# Altium schematic sheet Lilypad_Schematic_1.SchDoc
size A4
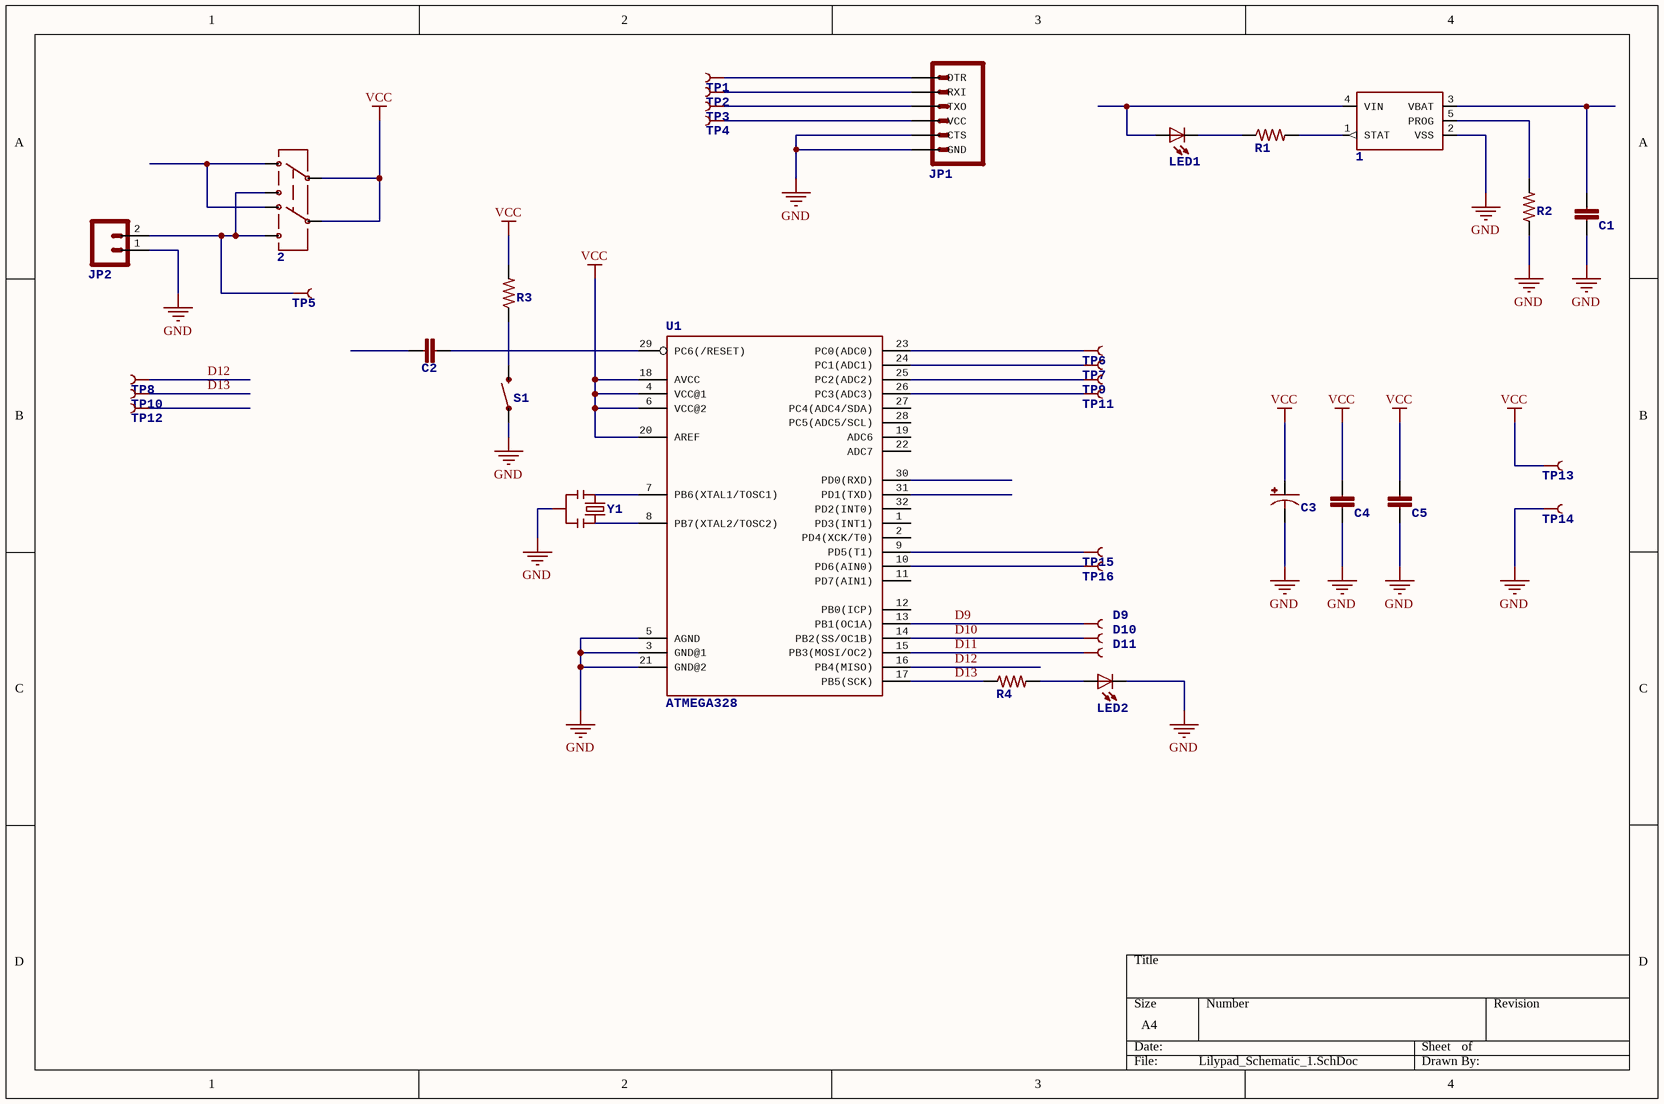
[diagram p0: Lilypad_Schematic_1.SchDoc]

## Parts
1  MCP73831  [SOT23-5]  (value not drawn)
2  AYZ0202  [AYZ0202]  (value not drawn)
C1  CAP0402-CAP  [0402-CAP]  (value not drawn)
C2  CAP0402-CAP  [0402-CAP]  (value not drawn)
C3  CAP_POL3528  [EIA3528]  (value not drawn)
C4  CAP0402-CAP  [0402-CAP]  (value not drawn)
C5  CAP0402-CAP  [0402-CAP]  (value not drawn)
D9  CONN  [PETAL-LONG-2]  (value not drawn)
D10  CONN  [PETAL-LONG-2]  (value not drawn)
D11  CONN  [PETAL-LONG-2]  (value not drawn)
JP1  ARDUINO_SERIAL_PROGRAMSMD  [1X06-SMD]  (value not drawn)
JP2  M02-JST-2MM-SMT  [JST-2-SMD]  (value not drawn)
LED1  LED0603  [LED-0603]  (value not drawn)
LED2  LED0603  [LED-0603]  (value not drawn)
R1  RESISTOR0402-RES  [0402-RES]  (value not drawn)
R2  RESISTOR0402-RES  [0402-RES]  (value not drawn)
R3  RESISTOR0402-RES  [0402-RES]  (value not drawn)
R4  RESISTOR0402-RES  [0402-RES]  (value not drawn)
S1  SWITCH-MOMENTARY-2SMD-2  [TACTILE_SWITCH_SMD-2]  (value not drawn)
TP1  TEST-POINT3X5  [PAD.03X.05]  (value not drawn)
TP2  TEST-POINT3X5  [PAD.03X.05]  (value not drawn)
TP3  TEST-POINT3X5  [PAD.03X.05]  (value not drawn)
TP4  TEST-POINT3X5  [PAD.03X.05]  (value not drawn)
TP5  TEST-POINT3X5  [PAD.03X.05]  (value not drawn)
TP6  CONN  [PETAL-LONG-2]  (value not drawn)
TP7  CONN  [PETAL-LONG-2]  (value not drawn)
TP8  TEST-POINT3X5  [PAD.03X.05]  (value not drawn)
TP9  CONN  [PETAL-LONG-2]  (value not drawn)
TP10  TEST-POINT3X5  [PAD.03X.05]  (value not drawn)
TP11  CONN  [PETAL-LONG-2]  (value not drawn)
TP12  TEST-POINT3X5  [PAD.03X.05]  (value not drawn)
TP13  CONN  [PETAL-LONG-2]  (value not drawn)
TP14  CONN  [PETAL-LONG-2]  (value not drawn)
TP15  CONN  [PETAL-LONG-2]  (value not drawn)
TP16  CONN  [PETAL-LONG-2]  (value not drawn)
U1  ATMEGA328  [TQFP32-08]
Y1  RESONATORSMD  [RESONATOR-SMD]  (value not drawn)

## Nets
GND: 1.2(VSS) C1.2 C3.C(-) C4.2 C5.2 JP1.5(CTS) JP1.6(GND) JP2.1 LED2.C R2.1 S1.2 TP14.1 U1.3(GND@1) U1.5(AGND) U1.21(GND@2) Y1.2
VCC: 2.2 2.5 C3.A(+) C4.1 C5.1 R3.2 TP13.1 U1.4(VCC@1) U1.6(VCC@2) U1.18(AVCC) U1.20(AREF)
D9: D9.1 U1.13(PB1(OC1A))
D10: D10.1 U1.14(PB2(SS/OC1B))
D11: D11.1 U1.15(PB3(MOSI/OC2))
D12: TP8.P$1 U1.16(PB4(MISO))
D13: R4.1 TP10.P$1 U1.17(PB5(SCK))
Net1_1: 1.1(STAT) R1.2
Net1_3: 1.3(VBAT) C1.1
Net1_4: 1.4(VIN) LED1.A
Net1_5: 1.5(PROG) R2.2
Net2_1: 2.1 2.4 JP2.2 TP5.P$1
Net2_3: 2.3 2.6
NetC2_2: C2.2 U1.29(PC6(/RESET))
NetJP1_1: JP1.1(DTR) TP1.P$1
NetJP1_2: JP1.2(RXI) TP2.P$1
NetJP1_3: JP1.3(TXO) TP3.P$1
NetJP1_4: JP1.4(VCC) TP4.P$1
NetLED1_C: LED1.C R1.1
NetLED2_A: LED2.A R4.2
NetR3_1: R3.1 S1.1
NetTP6_1: TP6.1 U1.23(PC0(ADC0))
NetTP7_1: TP7.1 U1.24(PC1(ADC1))
NetTP9_1: TP9.1 U1.25(PC2(ADC2))
NetTP11_1: TP11.1 U1.26(PC3(ADC3))
NetTP15_1: TP15.1 U1.9(PD5(T1))
NetTP16_1: TP16.1 U1.10(PD6(AIN0))
NetU1_7: U1.7(PB6(XTAL1/TOSC1)) Y1.1
NetU1_8: U1.8(PB7(XTAL2/TOSC2)) Y1.3

Not connected (* = marked no-connect by the designer): C2 1; TP12 P$1(1); U1 1(PD3(INT1)) 2(PD4(XCK/T0)) 11(PD7(AIN1)) 12(PB0(ICP)) 19(ADC6) 22(ADC7) 27(PC4(ADC4/SDA)) 28(PC5(ADC5/SCL)) 30(PD0(RXD)) 31(PD1(TXD)) 32(PD2(INT0))